# Altium schematic sheet schematic.SchDoc: Zadatak 2
size 241 x 190 mm; DrawnBy: Grupa 4; Revision: v1.0; SheetNumber: 1; SheetTotal: 1
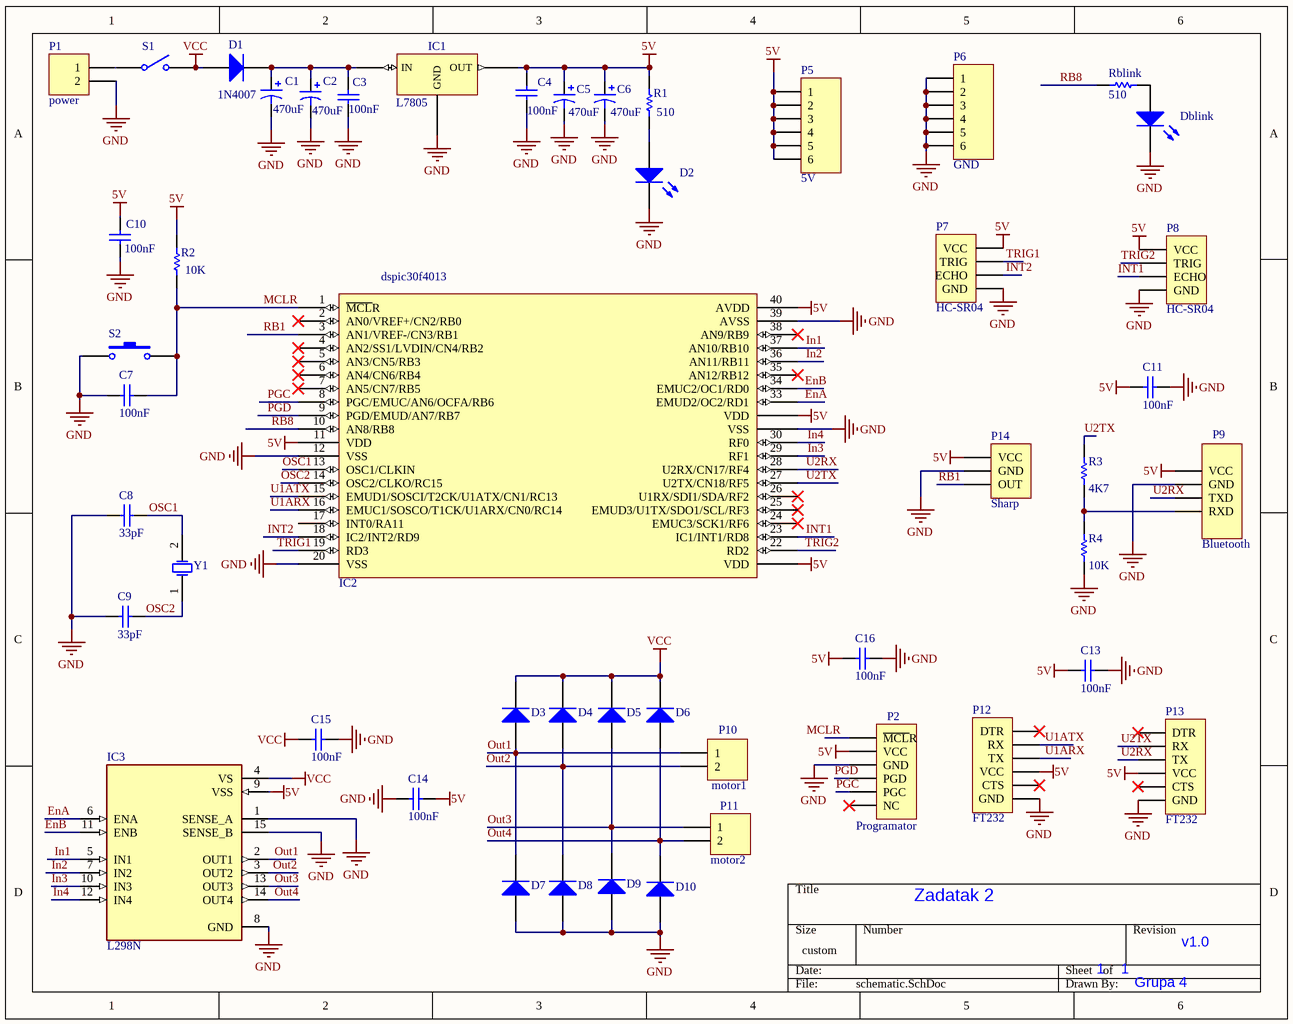
[diagram p0: schematic.SchDoc]

## Parts
C1  value 470uF  [elektrolit]  (hidden comment: Cap Pol1)
C2  value 470uF  [elektrolit]  (hidden comment: Cap Pol1)
C3  value 100nF  [keramicki]  (hidden comment: Cap)
C4  value 100nF  [keramicki]  (hidden comment: Cap)
C5  value 470uF  [elektrolit]  (hidden comment: Cap Pol1)
C6  value 470uF  [elektrolit]  (hidden comment: Cap Pol1)
C7  value 100nF  [keramicki]  (hidden comment: Cap)
C8  value 33pF  [keramicki]  (hidden comment: Cap)
C9  value 33pF  [keramicki]  (hidden comment: Cap)
C10  value 100nF  [keramicki]  (hidden comment: Cap)
C11  value 100nF  [keramicki]  (hidden comment: Cap)
C13  value 100nF  [keramicki]  (hidden comment: Cap)
C14  value 100nF  [keramicki]  (hidden comment: Cap)
C15  value 100nF  [keramicki]  (hidden comment: Cap)
C16  value 100nF  [keramicki]  (hidden comment: Cap)
D1  1N4007  [DIOD]
D2  LED0  [led]  (value not drawn)
D3  Diode 1N4007  [DIOD]  (value not drawn)
D4  Diode 1N4007  [DIOD]  (value not drawn)
D5  Diode 1N4007  [DIOD]  (value not drawn)
D6  Diode 1N4007  [DIOD]  (value not drawn)
D7  Diode 1N4007  [DIOD]  (value not drawn)
D8  Diode 1N4007  [DIOD]  (value not drawn)
D9  Diode 1N4007  [DIOD]  (value not drawn)
D10  Diode 1N4007  [DIOD]  (value not drawn)
Dblink  LED0  [led]  (value not drawn)
IC1  L7805  [stabilizator]
IC2  dspic30f4013  [dspic]
IC3  L298N  [l298n]
P1  power  [terminal2]
P2  Programator  [HDR1X5]
P5  5V  [HDR1X3]
P6  GND  [HDR1X3]
P7  HC-SR04  [HDR1X4]
P8  HC-SR04  [HDR1X4]
P9  Bluetooth  [HDR1X4]
P10  motor1  [terminal2]
P11  motor2  [terminal2]
P12  FT232  [HDR1X6]
P13  FT232  [HDR1X6]
P14  Sharp  [HDR1X3]
R1  value 510  [otp]  (hidden comment: Res1)
R2  value 10K  [otp]  (hidden comment: Res1)
R3  value 4K7  [otp]  (hidden comment: Res1)
R4  value 10K  [otp]  (hidden comment: Res1)
Rblink  value 510  [otp]  (hidden comment: Res1)
S1  SW-SPST  [Prekidac]  (value not drawn)
S2  SW-PB  [taster]  (value not drawn)
Y1  XTAL  [oscilator]  (value not drawn)

## Nets
5V: C4.2 C5.1 C6.1 C10.2 C11.2 C13.2 C14.2 C16.2 IC1.3(OUT) IC2.11(VDD) IC2.21(VDD) IC2.32(VDD) IC2.40(AVDD) IC3.9(VSS) P2.2(VCC) P5.1 P5.2 P5.3 P5.4 P5.5 P5.6 P7.1(VCC) P8.1(VCC) P9.1(VCC) P12.4(VCC) P13.4(VCC) P14.1(VCC) R1.2 R2.2
GND: C1.2 C2.2 C3.1 C4.1 C5.2 C6.2 C7.1 C8.2 C9.2 C10.1 C11.1 C13.1 C14.1 C15.1 C16.1 D2.2(K) D7.1(A) D8.1(A) D9.1(A) D10.1(A) Dblink.2(K) IC1.2(GND) IC2.12(VSS) IC2.20(VSS) IC2.31(VSS) IC2.39(AVSS) IC3.1(SENSE_A) IC3.8(GND) IC3.15(SENSE_B) P1.2 P2.3(GND) P6.1 P6.2 P6.3 P6.4 P6.5 P6.6 P7.4(GND) P8.4(GND) P9.2(GND) P12.6(GND) P13.6(GND) P14.2(GND) R4.1 S2.1
VCC: C15.2 D1.1(A) D3.2(K) D4.2(K) D5.2(K) D6.2(K) IC3.4(VS) S1.2(NO)
EnA: IC2.33(EMUD2/OC2/RD1) IC3.6(ENA)
EnB: IC2.34(EMUC2/OC1/RD0) IC3.11(ENB)
In1: IC2.37(AN10/RB10) IC3.5(IN1)
In2: IC2.36(AN11/RB11) IC3.7(IN2)
In3: IC2.29(RF1) IC3.10(IN3)
In4: IC2.30(RF0) IC3.12(IN4)
INT1: IC2.23(IC1/INT1/RD8) P8.3(ECHO)
INT2: IC2.18(IC2/INT2/RD9) P7.3(ECHO)
MCLR: C7.2 IC2.1(~{MCL}R) P2.1(~{MCL}R) R2.1 S2.2
OSC1: C8.1 IC2.13(OSC1/CLKIN) Y1.2(OSC2)
OSC2: C9.1 IC2.14(OSC2/CLKO/RC15) Y1.1(OSC1)
Out1: D3.1(A) D7.2(K) IC3.2(OUT1) P10.1
Out2: D4.1(A) D8.2(K) IC3.3(OUT2) P10.2
Out3: D5.1(A) D9.2(K) IC3.13(OUT3) P11.1
Out4: D6.1(A) D10.2(K) IC3.14(OUT4) P11.2
PGC: IC2.8(PGC/EMUC/AN6/OCFA/RB6) P2.5(PGC)
PGD: IC2.9(PGD/EMUD/AN7/RB7) P2.4(PGD)
RB1: IC2.3(AN1/VREF-/CN3/RB1) P14.3(OUT)
RB8: IC2.10(AN8/RB8) Rblink.2
TRIG1: IC2.19(RD3) P7.2(TRIG)
TRIG2: IC2.22(RD2) P8.2(TRIG)
U1ARX: IC2.16(EMUC1/SOSCO/T1CK/U1ARX/CN0/RC14) P12.3(TX)
U1ATX: IC2.15(EMUD1/SOSCI/T2CK/U1ATX/CN1/RC13) P12.2(RX)
U2RX: IC2.28(U2RX/CN17/RF4) P9.3(TXD) P13.3(TX)
U2TX: IC2.27(U2TX/CN18/RF5) P13.2(RX) R3.2
NetC1_1: C1.1 C2.1 C3.2 D1.2(K) IC1.1(IN)
NetD2_1: D2.1(A) R1.1
NetDblink_1: Dblink.1(A) Rblink.1
NetP1_1: P1.1 S1.1(COMMON)
NetP9_4: P9.4(RXD) R3.1 R4.2

Not connected (* = marked no-connect by the designer): IC2 2(AN0/VREF+/CN2/RB0)* 4(AN2/SS1/LVDIN/CN4/RB2)* 5(AN3/CN5/RB3)* 6(AN4/CN6/RB4)* 7(AN5/CN7/RB5)* 17(INT0/RA11) 24(EMUC3/SCK1/RF6)* 25(EMUD3/U1TX/SDO1/SCL/RF3)* 26(U1RX/SDI1/SDA/RF2)* 35(AN12/RB12)* 38(AN9/RB9)*; P2 6(NC)*; P12 1(DTR)* 5(CTS)*; P13 1(DTR)* 5(CTS)*

## Library data of the parts
C1 C2 C5 C6 = Cap Pol1: Polarized Capacitor (Radial); Published: 8-Jun-2000; LatestRevisionDate: 17-Jul-2002; LatestRevisionNote: Re-released for DXP Platform.; PackageReference: RB7.6-15; Publisher: Altium Limited; PackageDescription: Polarized Capacitor (Radial); 2 Leads
C3 C4 C7-C11 C13-C16 = Cap: Capacitor; Published: 8-Jun-2000; LatestRevisionDate: 17-Jul-2002; LatestRevisionNote: Re-released for DXP Platform.; PackageReference: RAD-0.3; Publisher: Altium Limited; PackageDescription: Radial Cap, Thru-Hole; 2 Leads; 0.3 in Pin Spacing
D1 D3-D10 = Diode 1N4007: 1 Amp General Purpose Rectifier; Published: 8-Jun-2000; LatestRevisionDate: 17-Jul-2002; LatestRevisionNote: Re-released for DXP Platform.; DatasheetVersion: 1998; PackageVersion: Aug-1999; PackageReference: DO-41; Publisher: Altium Limited; PackageDescription: Diode, Axial; Body 5.2 x 2.7 mm (LxDia. max), Lead Dia. 0.86 mm (max); Code_JEDEC: DO-204-AL; ComponentLink1Description: Manufacturer Link; ComponentLink1URL: http://www.fairchildsemi.com/; ComponentLink2Description: Datasheet; ComponentLink2URL: http://www.fairchildsemi.com/ds/1N%2F1N4001.pdf
D2 Dblink = LED0: Typical INFRARED GaAs LED; Published: 8-Jun-2000; LatestRevisionDate: 08-Jul-2005; LatestRevisionNote: Mech Layer 1 removed.; PackageReference: LED-0; Publisher: Altium Limited; PackageDescription: LED; 2 Leads
IC3 = L298N: Dual Full Bridge Motor Driver 15-Pin(15+Tab) MULTIWATT V Tube; MP: L298N; Availability: Unavailable; Package: None; Value: *; Price: None
P1 P10 P11 = Header 2: Header, 2-Pin; LatestRevisionDate: 17-Jul-2002; LatestRevisionNote: Re-released for DXP Platform.; Publisher: Altium Limited
P2 P5 P6 P9 P12 P13 = Header 6: Header, 6-Pin; LatestRevisionDate: 17-Jul-2002; LatestRevisionNote: Re-released for DXP Platform.; Publisher: Altium Limited
P7 P8 = Header 4: Header, 4-Pin; LatestRevisionDate: 17-Jul-2002; LatestRevisionNote: Re-released for DXP Platform.; Publisher: Altium Limited
P14 = Header 3: Header, 3-Pin; LatestRevisionDate: 17-Jul-2002; LatestRevisionNote: Re-released for DXP Platform.; Publisher: Altium Limited
R1-R4 Rblink = Res1: Resistor; Published: 8-Jun-2000; LatestRevisionDate: 17-Jul-2002; LatestRevisionNote: Re-released for DXP Platform.; PackageReference: AXIAL-0.3; Publisher: Altium Limited; PackageDescription: Axial Device, Thru-Hole; 2 Leads; 0.3 in Pin Spacing
S1 = SW-SPST: Single-Pole, Single-Throw Switch; Published: 24-Mar-1999; LatestRevisionDate: 17-Jul-2002; LatestRevisionNote: Re-released for DXP Platform.; PackageReference: SPST-2; Publisher: Altium Limited; PackageDescription: Switch; 2 Leads
S2 = SW-PB: Switch; Published: 24-Mar-1999; LatestRevisionDate: 17-Jul-2002; LatestRevisionNote: Re-released for DXP Platform.; PackageReference: SPST-2; Publisher: Altium Limited; PackageDescription: Switch; 2 Leads
Y1 = XTAL: Crystal Oscillator; Published: 8-Jun-2000; LatestRevisionDate: 17-Jul-2002; LatestRevisionNote: Re-released for DXP Platform.; PackageReference: R38; Publisher: Altium Limited; PackageDescription: Crystal, Thru-Hole; 2 Leads; Body 3.1 x 8.2 mm (Dia.xH)